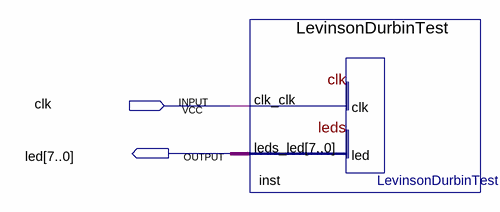
[diagram p0: schematic sheet]
// Quartus schematic top_LevinsonDurbinTest.bdf as structural Verilog: 1 symbols, 2 pins
module top_LevinsonDurbinTest (
  input  clk,
  output [7:0] led
);

  LevinsonDurbinTest inst (.clk_clk(clk), .leds_led(led));
endmodule
